# Altium schematic sheet MotherBoard.SchDoc: Kapitoshka
size 594 x 420 mm; ApprovedBy: Алексеев; CheckedBy: Алексеев; DrawnBy: Подлесный; DocumentNumber: СКТБ.280317.002 Э3; SheetNumber: 1; Format: A2; DocumentType: Схема электрическая принципиальная; ImagePath: Введите номер платы
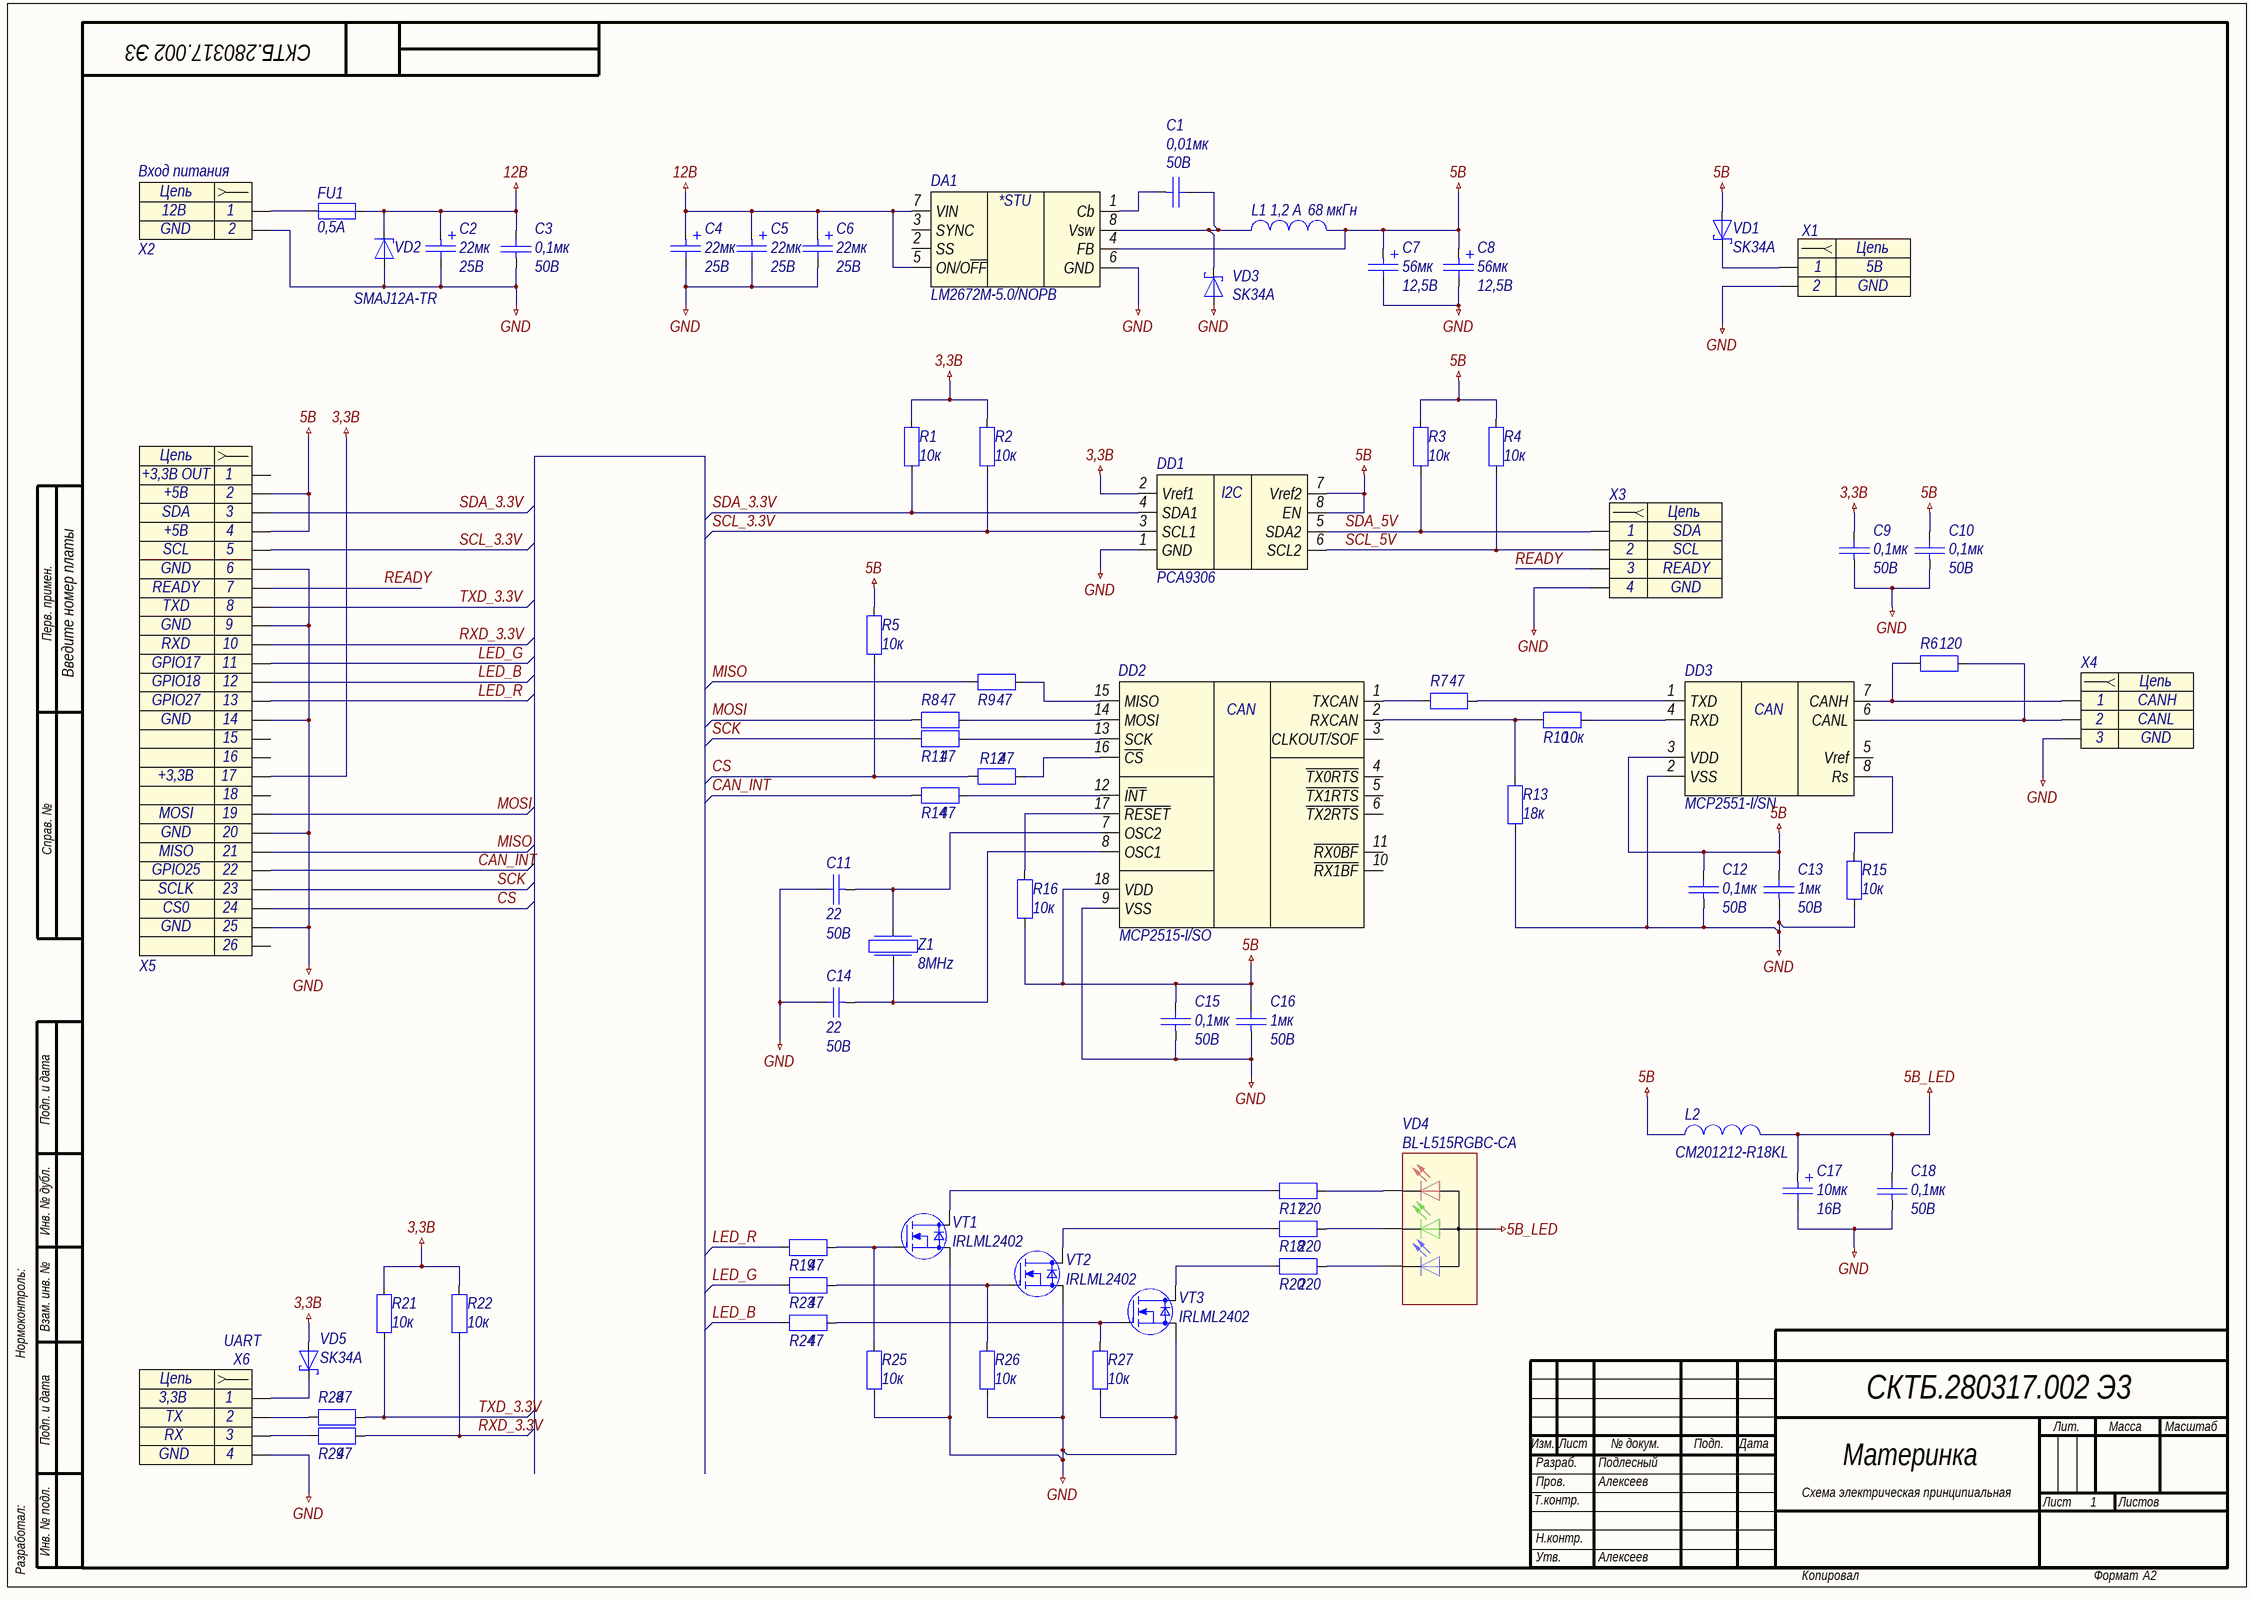
[diagram p0: MotherBoard.SchDoc]

## Parts
C1  Voltage: 50В  [C0805]  (hidden comment: 0,01мк)
C2  22мк  Voltage: 25В  [TANTAL CASE D]
C3  Voltage: 50В  [C0805]  (hidden comment: 0,1мк)
C4  22мк  Voltage: 25В  [TANTAL CASE D]
C5  22мк  Voltage: 25В  [TANTAL CASE D]
C6  22мк  Voltage: 25В  [TANTAL CASE D]
C7  56мк  Voltage: 12,5В  [TANTAL CASE D]
C8  56мк  Voltage: 12,5В  [TANTAL CASE D]
C9  Voltage: 50В  [C0805]  (hidden comment: 0,1мк)
C10  Voltage: 50В  [C0805]  (hidden comment: 0,1мк)
C11  Voltage: 50В  [C0805]  (hidden comment: 22)
C12  Voltage: 50В  [C0805]  (hidden comment: 0,1мк)
C13  Voltage: 50В  [C0805]  (hidden comment: 1мк)
C14  Voltage: 50В  [C0805]  (hidden comment: 22)
C15  Voltage: 50В  [C0805]  (hidden comment: 0,1мк)
C16  Voltage: 50В  [C0805]  (hidden comment: 1мк)
C17  10мк  Voltage: 16В  [TANTAL CASE B]
C18  Voltage: 50В  [C0805]  (hidden comment: 0,1мк)
DA1  LM2672M-5.0/NOPB  [SO8]
DD1  PCA9306  [SSOP8]
DD2  MCP2515-I/SO  [SO-18]
DD3  MCP2551-I/SN  [SO8]
FU1  value 0,5A  [FUSE812]  (hidden comment: MF-MSMF050)
L1  value 68 мкГн  Imax: 1,2 A  [IND_B82464G4223M]  (hidden comment: B82464G4683M)
L2  CM201212-R18KL  [L0805]
R1  10к  [R0805]
R2  10к  [R0805]
R3  10к  [R0805]
R4  10к  [R0805]
R5  10к  [R0805]
R6  120  [R0805]
R7  47  [R0805]
R8  47  [R0805]
R9  47  [R0805]
R10  10к  [R0805]
R11  47  [R0805]
R12  47  [R0805]
R13  18к  [R0805]
R14  47  [R0805]
R15  10к  [R0805]
R16  10к  [R0805]
R17  220  [R0805]
R18  220  [R0805]
R19  47  [R0805]
R20  220  [R0805]
R21  10к  [R0805]
R22  10к  [R0805]
R23  47  [R0805]
R24  47  [R0805]
R25  10к  [R0805]
R26  10к  [R0805]
R27  10к  [R0805]
R28  47  [R0805]
R29  47  [R0805]
VD1  SK34A  [SMA]
VD2  SMAJ12A-TR  [SMA]
VD3  SK34A  [SMA]
VD4  BL-L515RGBC-CA  [RGB_LED]
VD5  SK34A  [SMA]
VT1  IRLML2402  [SOT23-3]
VT2  IRLML2402  [SOT23-3]
VT3  IRLML2402  [SOT23-3]
X1  (no value)  [MW-2M_without3D]
X2  Вход питания  [MW-2M]
X3  (no value)  [MW-4M_without3D]
X4  (no value)  [MW-3M]
X5  (no value)  [PLS-26]
X6  UART  [MW-4MR]
Z1  8MHz  [QSMD5.0x3.2x1.0]

## Nets
3,3B: C9.2 DD1.2(Vref1) R1.2 R2.2 R21.2 R22.2 VD5.2(A) X5.17
5B: C7.1 C8.1 C10.2 C12.2 C13.2 C15.2 C16.2 DA1.4(FB) DD1.7(Vref2) DD1.8(EN) DD2.18(VDD) DD3.3(VDD) L1.2 L2.1 R3.2 R4.2 R5.2 R16.1 VD1.2(A) X5.2 X5.4
5B_LED: C17.1 C18.2 L2.2 VD4.3(A)
12B: C2.1 C3.2 C4.1 C5.1 C6.1 DA1.5(ON/O~{FF}) DA1.7(VIN) FU1.2 VD2.1(K)
GND: C2.2 C3.1 C4.2 C5.2 C6.2 C7.2 C8.2 C9.1 C10.1 C11.2 C12.1 C13.1 C14.2 C15.1 C16.1 C17.2 C18.1 DA1.6(GND) DD1.1(GND) DD2.9(VSS) DD3.2(VSS) R13.1 R15.1 R25.1 R26.1 R27.1 VD2.2(A) VD3.2(A) VT1.2(S) VT2.2(S) VT3.2(S) X1.2 X2.2 X3.4 X4.3 X5.6 X5.9 X5.14 X5.20 X5.25 X6.4
CAN_INT: R14.1 X5.22
CS: R5.1 R12.1 X5.24
LED_B: R24.1 X5.12
LED_G: R23.1 X5.11
LED_R: R19.1 X5.13
MISO: R9.1 X5.21
MOSI: R8.1 X5.19
READY: X3.3 X5.7
RXD_3.3V: R22.1 R29.2 X5.10
SCK: R11.1 X5.23
SCL_3.3V: DD1.3(SCL1) R2.1 X5.5
SCL_5V: DD1.6(SCL2) R4.1 X3.2
SDA_3.3V: DD1.4(SDA1) R1.1 X5.3
SDA_5V: DD1.5(SDA2) R3.1 X3.1
TXD_3.3V: R21.1 R28.2 X5.8
NetC1_1: C1.1 DA1.1(Cb)
NetC1_2: C1.2 DA1.8(Vsw) L1.1 VD3.1(K)
NetC11_1: C11.1 DD2.7(OSC2) Z1.2
NetC14_1: C14.1 DD2.8(OSC1) Z1.1
NetDD2_1: DD2.1(TXCAN) R7.1
NetDD2_2: DD2.2(RXCAN) R10.1 R13.2
NetDD2_12: DD2.12(I~{NT}) R14.2
NetDD2_13: DD2.13(SCK) R11.2
NetDD2_14: DD2.14(MOSI) R8.2
NetDD2_15: DD2.15(MISO) R9.2
NetDD2_16: DD2.16(~{CS}) R12.2
NetDD2_17: DD2.17(~{RESET}) R16.2
NetDD3_1: DD3.1(TXD) R7.2
NetDD3_4: DD3.4(RXD) R10.2
NetDD3_6: DD3.6(CANL) R6.2 X4.2
NetDD3_7: DD3.7(CANH) R6.1 X4.1
NetDD3_8: DD3.8(Rs) R15.2
NetFU1_1: FU1.1 X2.1
NetR17_1: R17.1 VT1.3(D)
NetR17_2: R17.2 VD4.4(K)
NetR18_1: R18.1 VT2.3(D)
NetR18_2: R18.2 VD4.2(K)
NetR19_2: R19.2 R25.2 VT1.1(G)
NetR20_1: R20.1 VT3.3(D)
NetR20_2: R20.2 VD4.1(K)
NetR23_2: R23.2 R26.2 VT2.1(G)
NetR24_2: R24.2 R27.2 VT3.1(G)
NetR28_1: R28.1 X6.2
NetR29_1: R29.1 X6.3
NetVD1_1: VD1.1(K) X1.1
NetVD5_1: VD5.1(K) X6.1

Not connected (* = marked no-connect by the designer): DA1 2(SS) 3(SYNC); DD2 3(CLKOUT/SOF) 4(~{TX0RTS}) 5(~{TX1RTS}) 6(~{TX2RTS}) 10(~{RX1BF}) 11(~{RX0BF}); DD3 5(Vref); X5 1 15 16 18 26

## Notes on the sheet
- Перв. примен.
- Справ. №
- Подп. и дата
- Инв. № дубл.
- Нормоконтроль:
- Взам. инв. №
- Изм.
- Лист
- № докум.
- Подп.
- Дата
- Лит.
- Масса
- Масштаб
- Т.контр.
- Пров.
- Разраб.
- Материнка
- Листов
- Разработал:
- Инв. № подл.
- Н.контр.
- Утв.
- Копировал
- Формат
- (in symbol Header_2_sct) Цепь
- (in symbol Header_3_sct) Цепь
- (in symbol Header_4_sct) Цепь
- (in symbol Header_26) Цепь
- (in symbol LM2672) *STU
- (in symbol MCP2515) CAN
- (in symbol MCP2551) CAN
- (in symbol PCA9306) I2C

## Library data of the parts
C1 C3 C9-C16 C18 = Capacitor: Конденсатор
  C1: Value: 0,01мк
  C3 C9 C10 C12 C15 C18: Value: 0,1мк
  C11 C14: Value: 22
  C13 C16: Value: 1мк
C2 C4-C6 C17 = Capacitor_pol: Конденсатор полярный
  C2 C4-C6: Value: 22мк
  C17: Value: 10мк
C7 C8 = Capacitor_pol: Конденсатор полярный; Name: ECASD91B566M020K; Value: 56мк
DA1 = LM2672: Power Converter High Efficiency 1-A Step-Down Voltage; Name: LM2672M-5.0/NOPB
DD1 = PCA9306: DUAL BIDIRECTIONAL I2C BUS AND SMBus VOLTAGE-LEVEL TRANSLATOR; Name: PCA9306DCTR
DD2 = MCP2515: CAN Controller With SPI™ Interface; Name: MCP2515-I/SO
DD3 = MCP2551: High-Speed CAN Transceiver; Name: MCP2551-I/SN
FU1 = Fuse: Предохранитель; Name: MF-MSMF050
L1 = Inductor: Катушка индуктивности; Name: B82464G4683M
L2 = Inductor: Катушка индуктивности; Value: XXX; Name: CM201212-R18KL
R1-R29 = Resistor: Резистор
  R1-R5 R10 R15 R16 R21 R22 R25-R27: Value: 10к
  R6: Value: 120
  R7-R9 R11 R12 R14 R19 R23 R24 R28 R29: Value: 47
  R13: Value: 18к
  R17 R18 R20: Value: 220
VD1 VD3 VD5 = DiodeSchottky: Диод Шоттки; Name: SK34A
VD2 = DiodeZener: Стабилитрон; Name: SMAJ12A-TR
VD4 = RGB_LED_A: RGB Светодиод с общим анодом; Name: BL-L515RGBC-CA
VT1-VT3 = N-MOSFET: Name: IRLML2402; Vgs: *; Vds: *; Ids: *
X1 = Header_2_sct: Разъем - 2 конт. розетка; Contact_1: 5B; Contact_2: GND
X2 = Header_2_sct: Разъем - 2 конт. розетка; Contact_1: 12B; Contact_2: GND; Name: Вход питания
X3 = Header_4_sct: Разъем - 4 конт. розетка; Contact_1: SDA; Contact_2: SCL; Contact_3: READY; Contact_4: GND
X4 = Header_3_sct: Разъем - 2 конт. розетка; Contact_1: CANH; Contact_2: CANL; Contact_3: GND
X5 = Header_26: Разъем - 5 конт. розетка; Contact_1: +3,3B OUT; Contact_2: +5B; Contact_3: SDA; Contact_5: SCL; Contact_7: READY; Contact_6: GND; Contact_8: TXD; Contact_10: RXD; Contact_11: GPIO17; Contact_12: GPIO18; Contact_13: GPIO27; Contact_17: +3,3B; Contact_19: MOSI; Contact_21: MISO; Contact_22: GPIO25; Contact_23: SCLK; Contact_24: CS0; Contact_9: GND; Contact_14: GND; Contact_20: GND; Contact_25: GND; Contact_4: +5B
X6 = Header_4_sct: Разъем - 4 конт. розетка; Contact_1: 3,3B; Contact_2: TX; Contact_3: RX; Contact_4: GND; Name: UART
Z1 = Crystal: Кварцевый резонатор; Value: 8MHz